# Altium schematic sheet SOCMainPage.SchDoc
size A3; SheetNumber: 1; SheetTotal: 19
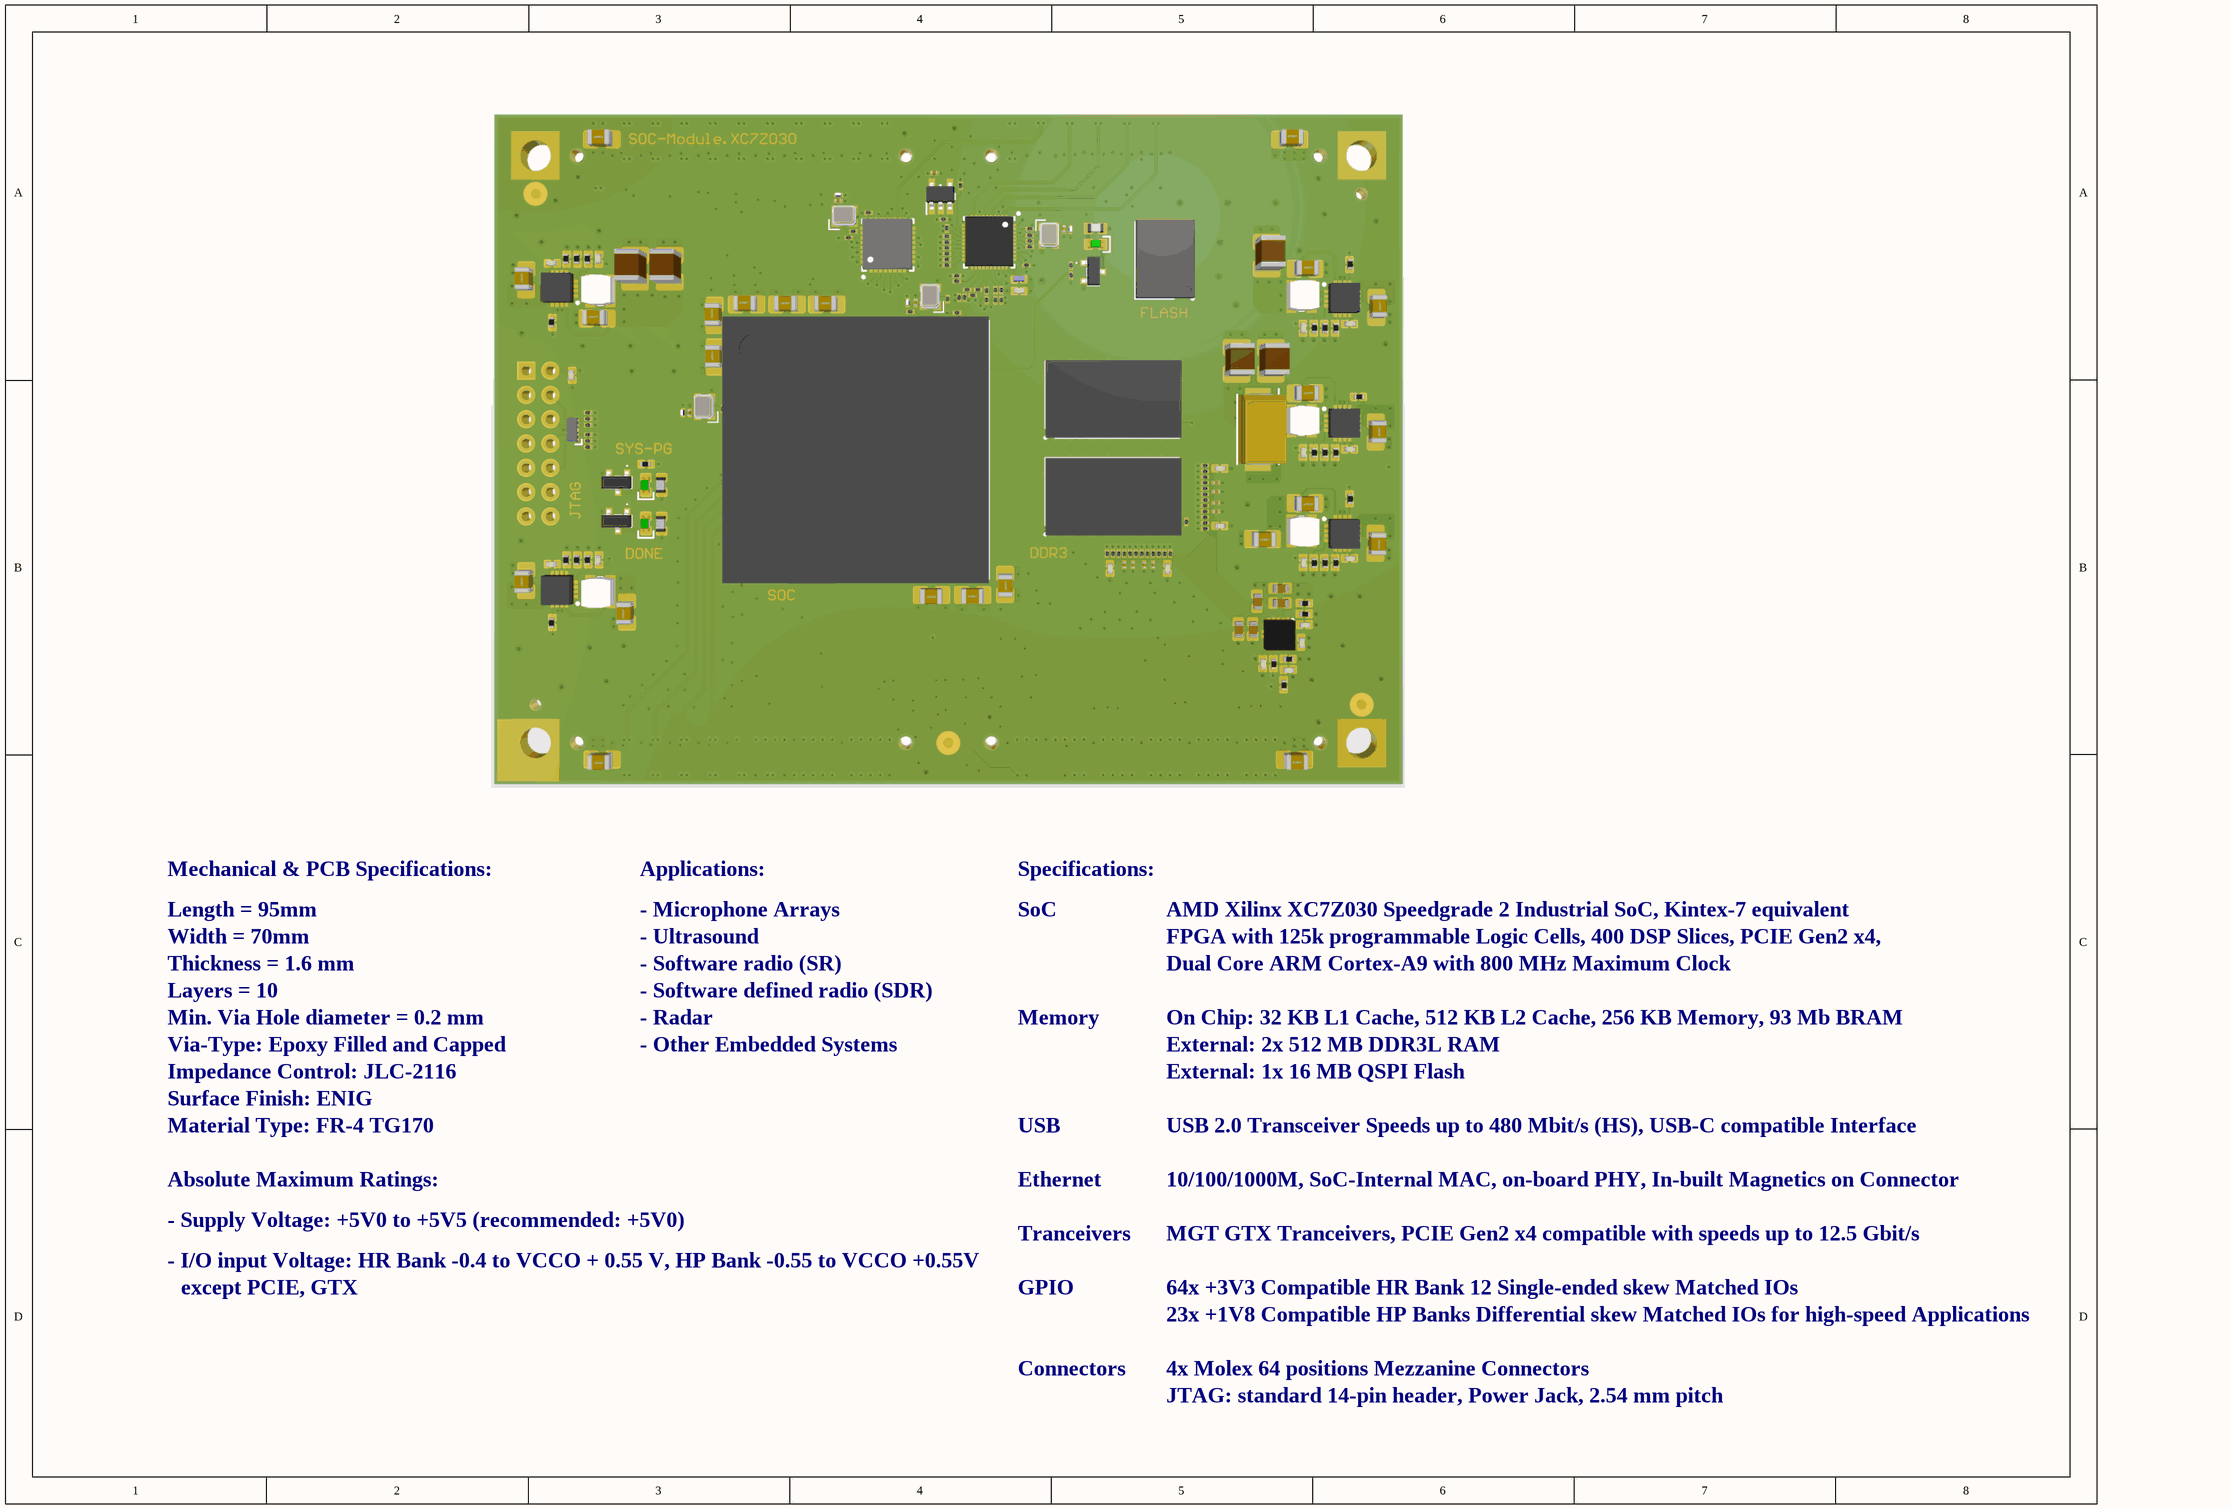
[diagram p0: SOCMainPage.SchDoc]

## Notes on the sheet
- Length = 95mm
- Mechanical & PCB Specifications:
- Applications:
- - Microphone Arrays
- Specifications:
- SoC
- AMD Xilinx XC7Z030 Speedgrade 2 Industrial SoC, Kintex-7 equivalent
- Width = 70mm
- Thickness = 1.6 mm
- - Software radio (SR)
- - Ultrasound
- FPGA with 125k programmable Logic Cells, 400 DSP Slices, PCIE Gen2 x4,
- Dual Core ARM Cortex-A9 with 800 MHz Maximum Clock
- Layers = 10
- Via-Type: Epoxy Filled and Capped
- Min. Via Hole diameter = 0.2 mm
- - Software defined radio (SDR)
- - Radar
- - Other Embedded Systems
- Memory
- On Chip: 32 KB L1 Cache, 512 KB L2 Cache, 256 KB Memory, 93 Mb BRAM
- External: 2x 512 MB DDR3L RAM
- Impedance Control: JLC-2116
- Surface Finish: ENIG
- External: 1x 16 MB QSPI Flash
- Material Type: FR-4 TG170
- Absolute Maximum Ratings:
- USB
- Ethernet
- USB 2.0 Transceiver Speeds up to 480 Mbit/s (HS), USB-C compatible Interface
- 10/100/1000M, SoC-Internal MAC, on-board PHY, In-built Magnetics on Connector
- - Supply Voltage: +5V0 to +5V5 (recommended: +5V0)
- Tranceivers
- MGT GTX Tranceivers, PCIE Gen2 x4 compatible with speeds up to 12.5 Gbit/s
- - I/O input Voltage: HR Bank -0.4 to VCCO + 0.55 V, HP Bank -0.55 to VCCO +0.55V
- except PCIE, GTX
- GPIO
- 64x +3V3 Compatible HR Bank 12 Single-ended skew Matched IOs
- 23x +1V8 Compatible HP Banks Differential skew Matched IOs for high-speed Applications
- Connectors
- 4x Molex 64 positions Mezzanine Connectors
- JTAG: standard 14-pin header, Power Jack, 2.54 mm pitch